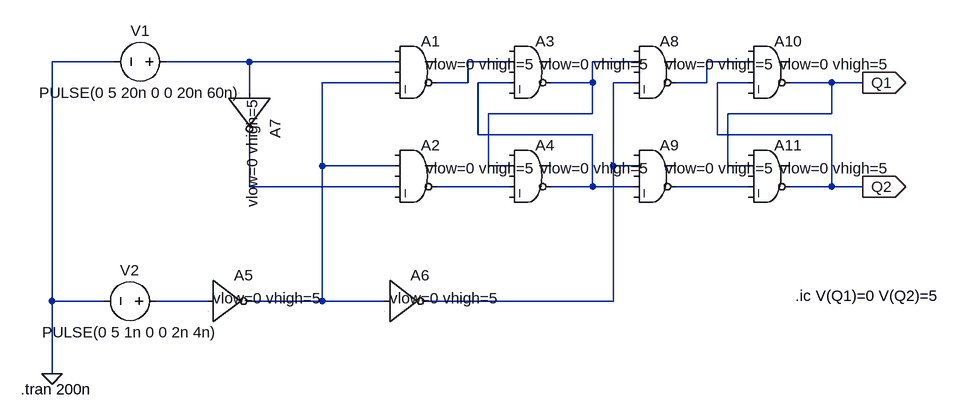
[diagram p0: schematic ms-d-flip-flop.asc]
ms-d-flip-flop.asc, the LTspice schematic file:
Version 4.1
SHEET 1 880 680
WIRE -464 64 -560 64
WIRE -256 64 -384 64
WIRE -32 64 -256 64
WIRE 144 64 80 64
WIRE 336 64 272 64
WIRE 512 64 448 64
WIRE -32 96 -144 96
WIRE 80 96 80 64
WIRE 80 96 32 96
WIRE 144 96 96 96
WIRE 272 96 272 64
WIRE 272 96 208 96
WIRE 336 96 304 96
WIRE 448 96 448 64
WIRE 448 96 400 96
WIRE 512 96 464 96
WIRE 640 96 576 96
WIRE 688 96 640 96
WIRE -256 112 -256 64
WIRE 272 144 272 96
WIRE 272 144 112 144
WIRE 640 144 640 96
WIRE 640 144 480 144
WIRE 96 176 96 96
WIRE 272 176 96 176
WIRE 464 176 464 96
WIRE 640 176 464 176
WIRE -144 224 -144 96
WIRE -32 224 -144 224
WIRE 112 224 112 144
WIRE 144 224 112 224
WIRE 304 224 304 96
WIRE 336 224 304 224
WIRE 480 224 480 144
WIRE 512 224 480 224
WIRE -256 256 -256 176
WIRE -32 256 -256 256
WIRE 144 256 32 256
WIRE 272 256 272 176
WIRE 272 256 208 256
WIRE 336 256 272 256
WIRE 512 256 400 256
WIRE 640 256 640 176
WIRE 640 256 576 256
WIRE 688 256 640 256
WIRE -560 432 -560 64
WIRE -480 432 -560 432
WIRE -320 432 -400 432
WIRE -144 432 -144 224
WIRE -144 432 -256 432
WIRE -48 432 -144 432
WIRE 304 432 304 224
WIRE 304 432 16 432
WIRE -560 544 -560 432
FLAG -560 544 0
FLAG 688 96 Q1
IOPIN 688 96 Out
FLAG 688 256 Q2
IOPIN 688 256 Out
SYMBOL Digital\\and 0 16 R0
WINDOW 3 16 52 Left 2
SYMATTR InstName A1
SYMATTR Value vlow=0 vhigh=5
SYMBOL Digital\\and 0 176 R0
WINDOW 3 16 52 Left 2
SYMATTR InstName A2
SYMATTR Value vlow=0 vhigh=5
SYMBOL voltage -368 64 R90
WINDOW 0 -32 56 VBottom 2
WINDOW 3 32 56 VTop 2
WINDOW 123 0 0 Left 0
WINDOW 39 0 0 Left 0
SYMATTR InstName V1
SYMATTR Value PULSE(0 5 20n 0 0 20n 60n)
SYMBOL voltage -384 432 R90
WINDOW 0 -32 56 VBottom 2
WINDOW 3 32 56 VTop 2
WINDOW 123 0 0 Left 0
WINDOW 39 0 0 Left 0
SYMATTR InstName V2
SYMATTR Value PULSE(0 5 1n 0 0 2n 4n)
SYMBOL Digital\\inv -320 368 R0
WINDOW 3 8 60 Left 2
SYMATTR InstName A5
SYMATTR Value vlow=0 vhigh=5
SYMBOL Digital\\inv -48 368 R0
WINDOW 3 8 60 Left 2
SYMATTR InstName A6
SYMATTR Value vlow=0 vhigh=5
SYMBOL Digital\\inv -192 112 R90
WINDOW 3 8 60 Left 2
SYMATTR InstName A7
SYMATTR Value vlow=0 vhigh=5
SYMBOL Digital\\and 176 16 R0
WINDOW 3 16 52 Left 2
SYMATTR InstName A3
SYMATTR Value vlow=0 vhigh=5
SYMBOL Digital\\and 176 176 R0
WINDOW 3 16 52 Left 2
SYMATTR InstName A4
SYMATTR Value vlow=0 vhigh=5
SYMBOL Digital\\and 368 16 R0
WINDOW 3 16 52 Left 2
SYMATTR InstName A8
SYMATTR Value vlow=0 vhigh=5
SYMBOL Digital\\and 368 176 R0
WINDOW 3 16 52 Left 2
SYMATTR InstName A9
SYMATTR Value vlow=0 vhigh=5
SYMBOL Digital\\and 544 16 R0
WINDOW 3 16 52 Left 2
SYMATTR InstName A10
SYMATTR Value vlow=0 vhigh=5
SYMBOL Digital\\and 544 176 R0
WINDOW 3 16 52 Left 2
SYMATTR InstName A11
SYMATTR Value vlow=0 vhigh=5
TEXT -608 568 Left 2 !.tran 200n
TEXT 584 424 Left 2 !.ic V(Q1)=0 V(Q2)=5

The netlist it stands for:
* ms-d-flip-flop.asc
A1 0 N001 0 N005 0 N002 0 0 AND vlow=0 vhigh=5
A2 0 N005 0 N008 0 N009 0 0 AND vlow=0 vhigh=5
V1 N001 0 PULSE(0 5 20n 0 0 20n 60n)
V2 N011 0 PULSE(0 5 1n 0 0 2n 4n)
A5 N011 0 0 0 0 N005 0 0 BUF vlow=0 vhigh=5
A6 N005 0 0 0 0 N007 0 0 BUF vlow=0 vhigh=5
A7 N001 0 0 0 0 N008 0 0 BUF vlow=0 vhigh=5
A3 0 N002 0 N006 0 N003 0 0 AND vlow=0 vhigh=5
A4 0 N003 0 N009 0 N006 0 0 AND vlow=0 vhigh=5
A8 0 N003 0 N007 0 N004 0 0 AND vlow=0 vhigh=5
A9 0 N007 0 N006 0 N010 0 0 AND vlow=0 vhigh=5
A10 0 N004 0 Q2 0 Q1 0 0 AND vlow=0 vhigh=5
A11 0 Q1 0 N010 0 Q2 0 0 AND vlow=0 vhigh=5
.tran 200n
.ic V(Q1)=0 V(Q2)=5
.backanno
.end